# EAGLE design smart hub v2_1 (EAGLE 9.6.2)
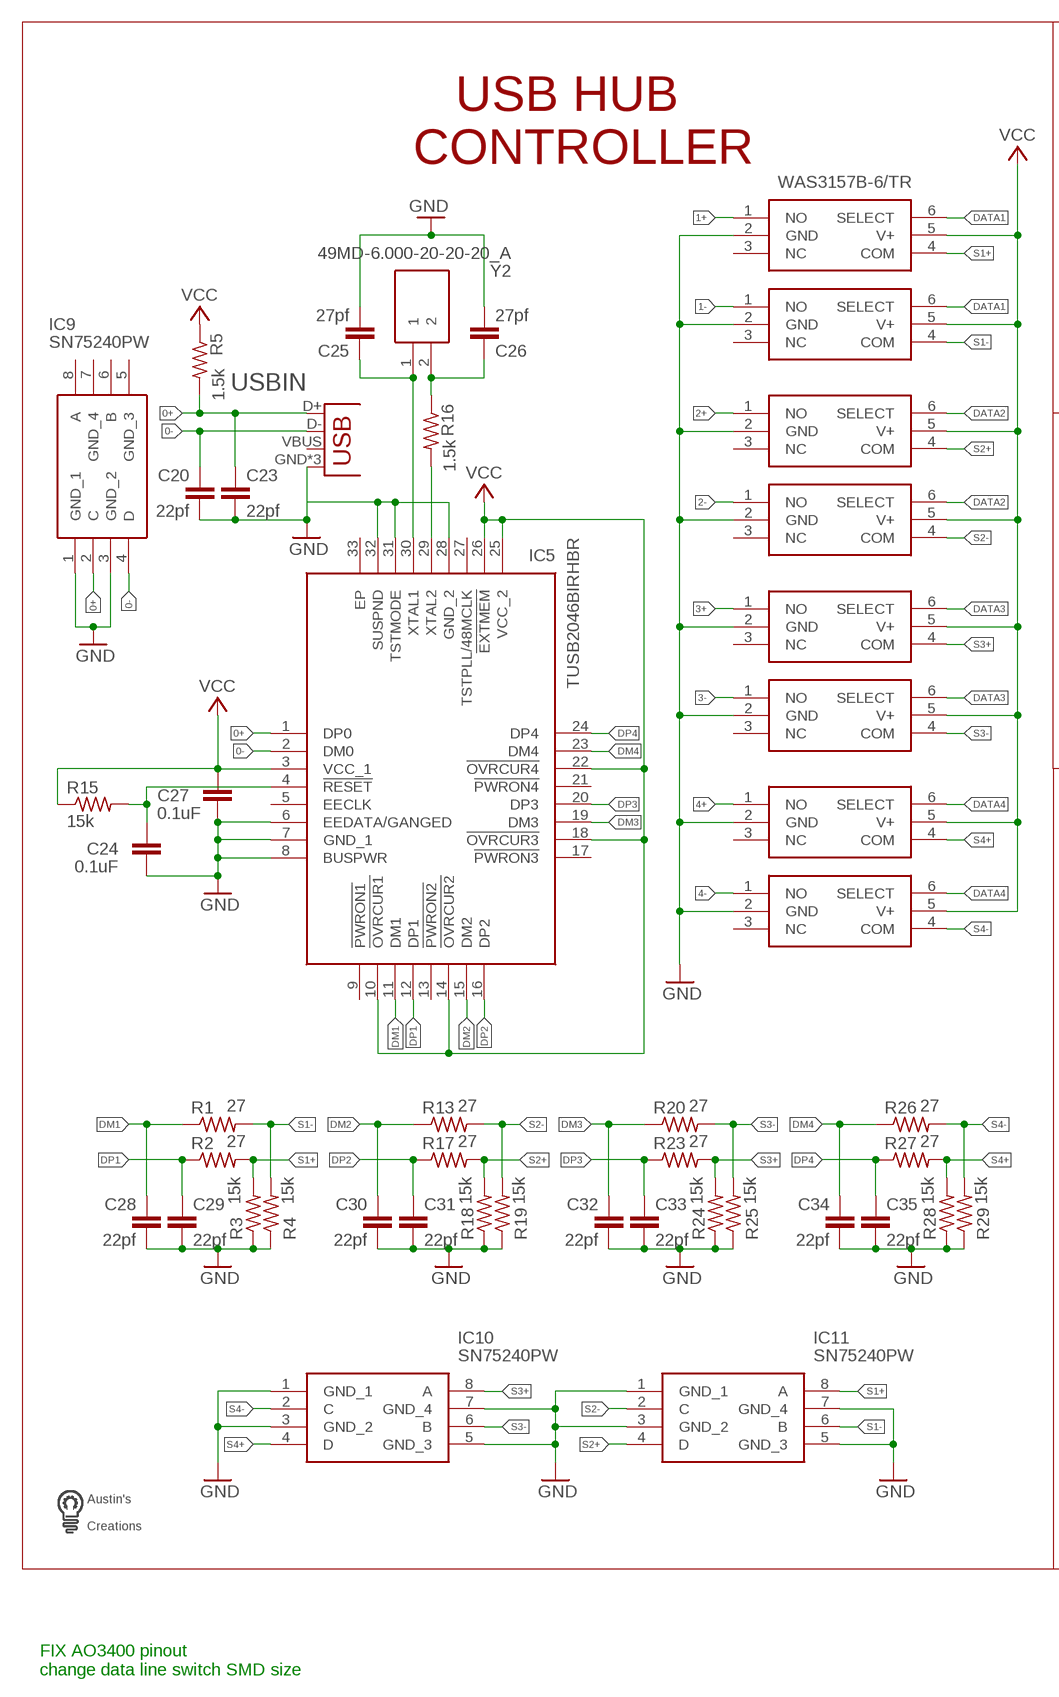
[diagram p0: schematic, sheet 1, part 1 of 2]
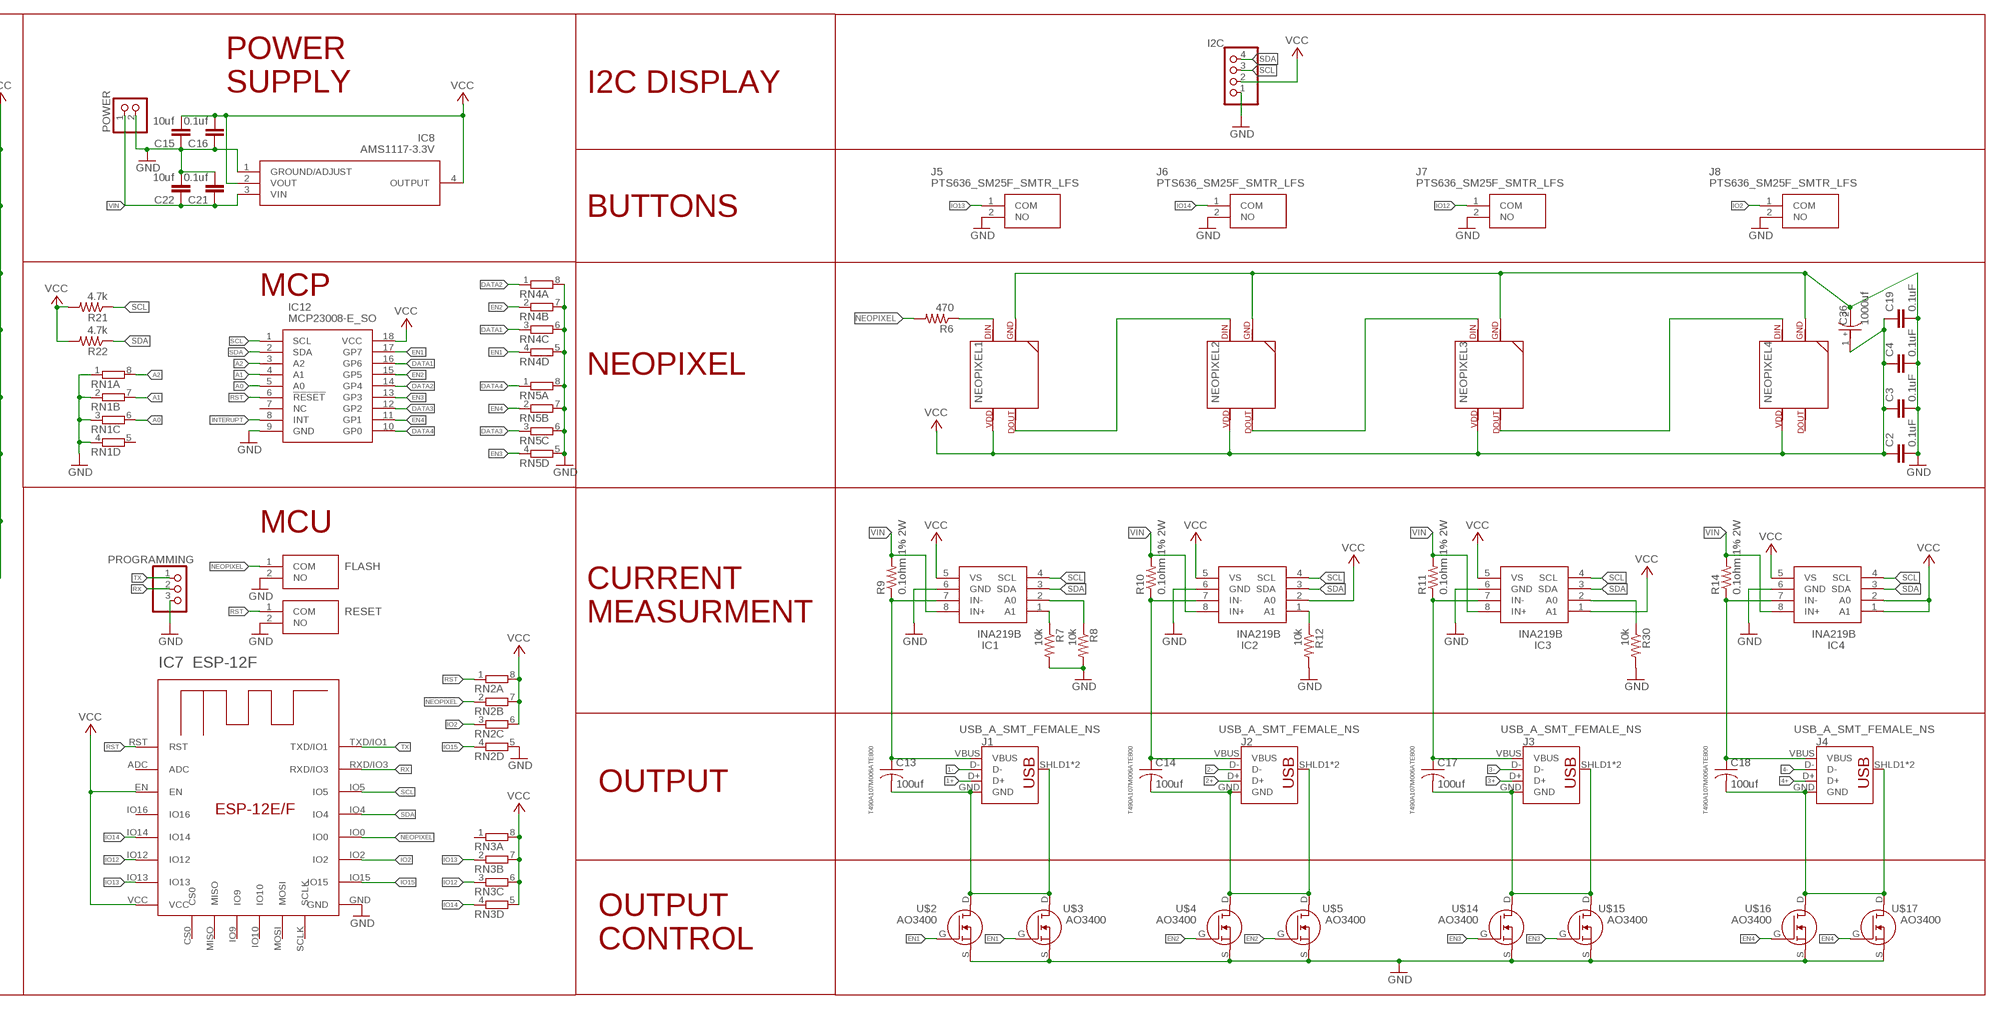
[diagram p1: schematic, sheet 1, part 2 of 2]

## Parts
C2  0.1uF  C-EUC0603  [C0603]
C3  0.1uF  C-EUC0603  [C0603]
C4  0.1uF  C-EUC0603  [C0603]
C13  100uf  C-USC1206  [C1206]
C14  100uf  C-USC1206  [C1206]
C15  10uf  C-EUC0603  [C0603]
C16  0.1uf  C-EUC0603  [C0603]
C17  100uf  C-USC1206  [C1206]
C18  100uf  C-USC1206  [C1206]
C19  0.1uF  C-EUC0603  [C0603]
C20  22pf  C-EUC0603  [C0603]
C21  0.1uf  C-EUC0603  [C0603]
C22  10uf  C-EUC0603  [C0603]
C23  22pf  C-EUC0603  [C0603]
C24  0.1uF  C-EUC0603  [C0603]
C25  27pf  C-EUC0603  [C0603]
C26  27pf  C-EUC0603  [C0603]
C27  0.1uF  C-EUC0603  [C0603]
C28  22pf  C-EUC0603  [C0603]
C29  22pf  C-EUC0603  [C0603]
C30  22pf  C-EUC0603  [C0603]
C31  22pf  C-EUC0603  [C0603]
C32  22pf  C-EUC0603  [C0603]
C33  22pf  C-EUC0603  [C0603]
C34  22pf  C-EUC0603  [C0603]
C35  22pf  C-EUC0603  [C0603]
C36  1000uf  EEE-0JA102P  [CAPAE1030X1050N]
FLASH  PTS636_SM25F_SMTR_LFS  [PTS636SM25FSMTRLFS]
I2C  PINHD-1X4  [1X04]
IC1  INA219B  INA219AIDR  [SOIC127P600X175-8N]
IC2  INA219B  INA219AIDR  [SOIC127P600X175-8N]
IC3  INA219B  INA219AIDR  [SOIC127P600X175-8N]
IC4  INA219B  INA219AIDR  [SOIC127P600X175-8N]
IC5  TUSB2046BIRHBR  [QFN50P500X500X100-33N]
IC7  ESP-12F  ESP-12E/F  [ESP-12E]
IC8  AMS1117-3.3V  [SOT229P700X180-4N]
IC9  SN75240PW  [SOP65P640X120-8N]
IC10  SN75240PW  [SOP65P640X120-8N]
IC11  SN75240PW  [SOP65P640X120-8N]
IC12  MCP23008-E_SO  [SOIC127P1030X265-18N]
J1  USB_A_SMT_FEMALE_NS  [USB-A-S-NOSILK-FEMALE]
J2  USB_A_SMT_FEMALE_NS  [USB-A-S-NOSILK-FEMALE]
J3  USB_A_SMT_FEMALE_NS  [USB-A-S-NOSILK-FEMALE]
J4  USB_A_SMT_FEMALE_NS  [USB-A-S-NOSILK-FEMALE]
J5  PTS636_SM25F_SMTR_LFS  [PTS636SM25FSMTRLFS]
J6  PTS636_SM25F_SMTR_LFS  [PTS636SM25FSMTRLFS]
J7  PTS636_SM25F_SMTR_LFS  [PTS636SM25FSMTRLFS]
J8  PTS636_SM25F_SMTR_LFS  [PTS636SM25FSMTRLFS]
NEOPIXEL1  SK6812NEOPIXEL5050  [SK6812]
NEOPIXEL2  SK6812NEOPIXEL5050  [SK6812]
NEOPIXEL3  SK6812NEOPIXEL5050  [SK6812]
NEOPIXEL4  SK6812NEOPIXEL5050  [SK6812]
POWER  PINHD-1X2  [1X02]
PROGRAMMING  PINHD-1X3  [1X03]
R1  27  R-US_R0603  [R0603]
R2  27  R-US_R0603  [R0603]
R3  15k  R-US_R0603  [R0603]
R4  15k  R-US_R0603  [R0603]
R5  1.5k  R-US_R0603  [R0603]
R6  470  R-US_R0603  [R0603]
R7  10k  R-US_R0603  [R0603]
R8  10k  R-US_R0603  [R0603]
R9  0.1ohm 1% 2W  R-US_R2512W  [R2512W]
R10  0.1ohm 1% 2W  R-US_R2512W  [R2512W]
R11  0.1ohm 1% 2W  R-US_R2512W  [R2512W]
R12  10k  R-US_R0603  [R0603]
R13  27  R-US_R0603  [R0603]
R14  0.1ohm 1% 2W  R-US_R2512W  [R2512W]
R15  15k  R-US_R0603  [R0603]
R16  1.5k  R-US_R0603  [R0603]
R17  27  R-US_R0603  [R0603]
R18  15k  R-US_R0603  [R0603]
R19  15k  R-US_R0603  [R0603]
R20  27  R-US_R0603  [R0603]
R21  4.7k  R-US_R0603  [R0603]
R22  4.7k  R-US_R0603  [R0603]
R23  27  R-US_R0603  [R0603]
R24  15k  R-US_R0603  [R0603]
R25  15k  R-US_R0603  [R0603]
R26  27  R-US_R0603  [R0603]
R27  27  R-US_R0603  [R0603]
R28  15k  R-US_R0603  [R0603]
R29  15k  R-US_R0603  [R0603]
R30  10k  R-US_R0603  [R0603]
RESET  PTS636_SM25F_SMTR_LFS  [PTS636SM25FSMTRLFS]
RN1  4R-N0603-ARC  [0603-ARC]
RN2  4R-N0603-ARC  [0603-ARC]
RN3  4R-N0603-ARC  [0603-ARC]
RN4  4R-N0603-ARC  [0603-ARC]
RN5  4R-N0603-ARC  [0603-ARC]
U$1  LOGOMASSIVE  [LOGOMASSIVE]
U$2  AO3400  [AO3400]
U$3  AO3400  [AO3400]
U$4  AO3400  [AO3400]
U$5  AO3400  [AO3400]
U$6  WAS3157B-6/TR  [WAS3157B-6/TR]
U$7  WAS3157B-6/TR  [WAS3157B-6/TR]
U$8  WAS3157B-6/TR  [WAS3157B-6/TR]
U$9  WAS3157B-6/TR  [WAS3157B-6/TR]
U$10  WAS3157B-6/TR  [WAS3157B-6/TR]
U$11  WAS3157B-6/TR  [WAS3157B-6/TR]
U$12  WAS3157B-6/TR  [WAS3157B-6/TR]
U$13  WAS3157B-6/TR  [WAS3157B-6/TR]
U$14  AO3400  [AO3400]
U$15  AO3400  [AO3400]
U$16  AO3400  [AO3400]
U$17  AO3400  [AO3400]
USBIN  USB-MICROB  [USB-MICROB]
Y2  49MD-6.000-20-20-20_A  [49MD6000202020A]

## Nets
0+: C23.1 IC5.1(DP0) IC9.2(C) R5.2 USBIN.D+
0-: C20.1 IC5.2(DM0) IC9.4(D) USBIN.D-
1+: J1.D+ U$6.1(NO)
1-: J1.D- U$7.1(NO)
2+: J2.D+ U$8.1(NO)
2-: J2.D- U$9.1(NO)
3+: J3.D+ U$10.1(NO)
3-: J3.D- U$11.1(NO)
4+: J4.D+ U$12.1(NO)
4-: J4.D- U$13.1(NO)
A0: IC12.5(A0) RN1.6
A1: IC12.4(A1) RN1.7
A2: IC12.3(A2) RN1.8
DATA1: IC12.16(GP6) RN4.3 U$6.6(SELECT) U$7.6(SELECT)
DATA2: IC12.14(GP4) RN4.1 U$8.6(SELECT) U$9.6(SELECT)
DATA3: IC12.12(GP2) RN5.3 U$10.6(SELECT) U$11.6(SELECT)
DATA4: IC12.10(GP0) RN5.1 U$12.6(SELECT) U$13.6(SELECT)
DM1: C28.1 IC5.11(DM1) R1.1
DM2: C30.1 IC5.15(DM2) R13.1
DM3: C32.1 IC5.19(DM3) R20.1
DM4: C34.1 IC5.23(DM4) R26.1
DP1: C29.1 IC5.12(DP1) R2.1
DP2: C31.1 IC5.16(DP2) R17.1
DP3: C33.1 IC5.20(DP3) R23.1
DP4: C35.1 IC5.24(DP4) R27.1
EN1: IC12.17(GP7) RN4.4 U$2.G U$3.G
EN2: IC12.15(GP5) RN4.2 U$4.G U$5.G
EN3: IC12.13(GP3) RN5.4 U$14.G U$15.G
EN4: IC12.11(GP1) RN5.2 U$16.G U$17.G
GND: C2.2 C3.2 C4.2 C15.1 C16.1 C19.2 C20.2 C21.2 C22.2 C23.2 C24.2 C25.2 C26.2 C27.2 C28.2 C29.2 C30.2 C31.2 C32.2 C33.2 C34.2 C35.2 C36.2(-) FLASH.2(NO) I2C.1 IC1.6(GND) IC2.6(GND) IC3.6(GND) IC4.6(GND) IC5.6(EEDATA/GANGED) IC5.7(GND_1) IC5.8(BUSPWR) IC5.28(GND_2) IC5.31(TSTMODE) IC5.32(SUSPND) IC7.GND IC8.1(GROUND/ADJUST) IC9.1(GND_1) IC9.3(GND_2) IC10.1(GND_1) IC10.3(GND_2) IC10.5(GND_3) IC10.7(GND_4) IC11.1(GND_1) IC11.3(GND_2) IC11.5(GND_3) IC11.7(GND_4) IC12.9(GND) J5.2(NO) J6.2(NO) J7.2(NO) J8.2(NO) NEOPIXEL1.3(GND) NEOPIXEL2.3(GND) NEOPIXEL3.3(GND) NEOPIXEL4.3(GND) POWER.2 PROGRAMMING.3 R3.1 R4.1 R7.2 R8.2 R12.2 R18.1 R19.1 R24.1 R25.1 R28.1 R29.1 R30.2 RESET.2(NO) RN1.1 RN1.2 RN1.3 RN1.4 RN2.5 RN4.5 RN4.6 RN4.7 RN4.8 RN5.5 RN5.6 RN5.7 RN5.8 U$2.S U$3.S U$4.S U$5.S U$6.2(GND) U$7.2(GND) U$8.2(GND) U$9.2(GND) U$10.2(GND) U$11.2(GND) U$12.2(GND) U$13.2(GND) U$14.S U$15.S U$16.S U$17.S USBIN.GND USBIN.MT1(GND) USBIN.MT2(GND)
INTERUPT: IC12.8(INT)
IO2: IC7.IO2 J8.1(COM) RN2.3
IO12: IC7.IO12 J7.1(COM) RN3.3
IO13: IC7.IO13 J5.1(COM) RN3.2
IO14: IC7.IO14 J6.1(COM) RN3.4
IO15: IC7.IO15 RN2.4
N$1: C13.2 J1.GND J1.SHLD1(SHIELD) J1.SHLD2(SHIELD) U$2.D U$3.D
N$2: C14.2 J2.GND J2.SHLD1(SHIELD) J2.SHLD2(SHIELD) U$4.D U$5.D
N$3: C25.1 IC5.30(XTAL1) Y2.1
N$4: C24.1 IC5.4(!RESET) R15.2
N$5: C26.1 R16.1 Y2.2
N$6: C17.2 J3.GND J3.SHLD1(SHIELD) J3.SHLD2(SHIELD) U$14.D U$15.D
N$7: IC5.29(XTAL2) R16.2
N$9: NEOPIXEL1.2(DOUT) NEOPIXEL2.4(DIN)
N$10: NEOPIXEL2.2(DOUT) NEOPIXEL3.4(DIN)
N$12: C18.2 J4.GND J4.SHLD1(SHIELD) J4.SHLD2(SHIELD) U$16.D U$17.D
N$13: IC3.2(A0) R30.1
N$14: IC2.1(A1) R12.1
N$15: IC1.1(A1) R7.1
N$16: IC1.2(A0) R8.1
N$17: NEOPIXEL1.4(DIN) R6.1
N$19: C13.1 IC1.7(IN-) J1.VBUS R9.1
N$20: NEOPIXEL3.2(DOUT) NEOPIXEL4.4(DIN)
N$21: C14.1 IC2.7(IN-) J2.VBUS R10.1
N$22: C17.1 IC3.7(IN-) J3.VBUS R11.1
N$24: C18.1 IC4.7(IN-) J4.VBUS R14.1
NEOPIXEL: FLASH.1(COM) IC7.IO0 R6.2 RN2.2
RST: IC7.RST IC12.6(!RESET) RESET.1(COM) RN2.1
RX: IC7.RXD/IO3 PROGRAMMING.2
S1+: IC11.8(A) R2.2 R3.2 U$6.4(COM)
S1-: IC11.6(B) R1.2 R4.2 U$7.4(COM)
S2+: IC11.4(D) R17.2 R18.2 U$8.4(COM)
S2-: IC11.2(C) R13.2 R19.2 U$9.4(COM)
S3+: IC10.8(A) R23.2 R24.2 U$10.4(COM)
S3-: IC10.6(B) R20.2 R25.2 U$11.4(COM)
S4+: IC10.4(D) R27.2 R28.2 U$12.4(COM)
S4-: IC10.2(C) R26.2 R29.2 U$13.4(COM)
SCL: I2C.3 IC1.4(SCL) IC2.4(SCL) IC3.4(SCL) IC4.4(SCL) IC7.IO5 IC12.1(SCL) R21.1
SDA: I2C.4 IC1.3(SDA) IC2.3(SDA) IC3.3(SDA) IC4.3(SDA) IC7.IO4 IC12.2(SDA) R22.1
TX: IC7.TXD/IO1 PROGRAMMING.1
VCC: C2.1 C3.1 C4.1 C15.2 C16.2 C19.1 C27.1 C36.1(+) I2C.2 IC1.5(VS) IC2.2(A0) IC2.5(VS) IC3.1(A1) IC3.5(VS) IC4.1(A1) IC4.2(A0) IC4.5(VS) IC5.3(VCC_1) IC5.10(!OVRCUR1) IC5.14(!OVRCUR2) IC5.18(!OVRCUR3) IC5.22(!OVRCUR4) IC5.25(VCC_2) IC5.26(!EXTMEM) IC7.EN IC7.VCC IC8.2(VOUT) IC8.4(OUTPUT) IC12.18(VCC) NEOPIXEL1.1(VDD) NEOPIXEL2.1(VDD) NEOPIXEL3.1(VDD) NEOPIXEL4.1(VDD) R5.1 R15.1 R21.2 R22.2 RN2.6 RN2.7 RN2.8 RN3.5 RN3.6 RN3.7 RN3.8 U$6.5(V+) U$7.5(V+) U$8.5(V+) U$9.5(V+) U$10.5(V+) U$11.5(V+) U$12.5(V+) U$13.5(V+)
VIN: C21.1 C22.1 IC1.8(IN+) IC2.8(IN+) IC3.8(IN+) IC4.8(IN+) IC8.3(VIN) POWER.1 R9.2 R10.2 R11.2 R14.2
Unconnected: IC5.5(EECLK) IC5.9(!PWRON1) IC5.13(!PWRON2) IC5.17(!PWRON3) IC5.21(!PWRON4) IC5.27(TSTPLL/48MCLK) IC5.33(EP) IC7.ADC IC7.CS0 IC7.IO9 IC7.IO10 IC7.IO16 IC7.MISO IC7.MOSI IC7.SCLK IC9.5(GND_3) IC9.6(B) IC9.7(GND_4) IC9.8(A) IC12.7(NC) NEOPIXEL4.2(DOUT) RN1.5 RN3.1 U$6.3(NC) U$7.3(NC) U$8.3(NC) U$9.3(NC) U$10.3(NC) U$11.3(NC) U$12.3(NC) U$13.3(NC) USBIN.VBUS

## Notes on the sheet
- POWER
  SUPPLY
- I2C DISPLAY
- USB HUB
  CONTROLLER
- BUTTONS
- MCP
- NEOPIXEL
- MCU
- CURRENT
  MEASURMENT
- OUTPUT
- T490A107M006ATE800 | T490A107M006ATE800 | T490A107M006ATE800 | T490A107M006ATE800
- OUTPUT
  CONTROL
- FIX AO3400 pinout
  change data line switch SMD size

## Library data of the parts
C2-C4 C15 C16 C19-C35 = rcl:C-EU: CAPACITOR, European symbol; SPICEPREFIX: C
C13 C14 C17 C18 = custom parts:C-US: CAPACITOR, American symbol; SPICEPREFIX: C
C36 = SamacSys_Parts:EEE-0JA102P: Panasonic 1000uF 6.3 V Aluminium Electrolytic Capacitor G, S(V) Series 2000h 10 x 10.2mm Source: Datasheet <https://componentsearchengine.com/Datasheets/1/EEE-0JA102P.pdf>; DESCRIPTION: Panasonic 1000uF 6.3 V Aluminium Electrolytic Capacitor G, S(V) Series 2000h 10 x 10.2mm; HEIGHT: 10.5mm; MANUFACTURER_NAME: Panasonic; MANUFACTURER_PART_NUMBER: EEE-0JA102P; MOUSER_PART_NUMBER: 667-EEE-0JA102P; MOUSER_PRICE-STOCK: https://www.mouser.com/Search/Refine.aspx?Keyword=667-EEE-0JA102P
FLASH J5-J8 RESET = SamacSys_Parts:PTS636_SM25F_SMTR_LFS: Tactile Switches Tact 50mA 12VDC, 6.0x3.5, 2.5mm H, 180gf, F leads, No ground pin, White Actuator Source: Datasheet <https://ms.componentsearchengine.com/Datasheets/1/PTS636 SM25F SMTR LFS.pdf>; ARROW_PART_NUMBER: PTS636 SM25F SMTR LFS; ARROW_PRICE-STOCK: https://www.arrow.com/en/products/pts636-sm25f-smtr-lfs/ck; DESCRIPTION: Tactile Switches Tact 50mA 12VDC, 6.0x3.5, 2.5mm H, 180gf, F leads, No ground pin, White Actuator; HEIGHT: 2.7mm; MANUFACTURER_NAME: C & K COMPONENTS; MANUFACTURER_PART_NUMBER: PTS636 SM25F SMTR LFS; MOUSER_PART_NUMBER: 611-PTS636SM25FSMTRL; MOUSER_PRICE-STOCK: https://www.mouser.co.uk/ProductDetail/CK/PTS636-SM25F-SMTR-LFS?qs=vLWxofP3U2wcBTQSwfMFOw%3D%3D
I2C = custom parts:PINHD-1X4: PIN HEADER
IC1-IC4 = SamacSys_Parts:INA219AIDR: 26-V, Bidirectional, Zero-Drift, High-Side, I2C Out Current/Power Monitor Source: Datasheet <http://www.ti.com/lit/gpn/ina219>; ARROW_PART_NUMBER: INA219AIDR; ARROW_PRICE-STOCK: https://www.arrow.com/en/products/ina219aidr/texas-instruments; DESCRIPTION: 26-V, Bidirectional, Zero-Drift, High-Side, I2C Out Current/Power Monitor; HEIGHT: 1.75mm; MANUFACTURER_NAME: Texas Instruments; MANUFACTURER_PART_NUMBER: INA219AIDR; MOUSER_PART_NUMBER: 595-INA219AIDR; MOUSER_PRICE-STOCK: https://www.mouser.co.uk/ProductDetail/Texas-Instruments/INA219AIDR?qs=XGzIaZb%2FFYIE5YcOHTnKDA%3D%3D
IC5 = SamacSys_Parts:TUSB2046BIRHBR: 4-Port USB 2.0 12 Mbps USB Full-Speed Hub Source: Datasheet <http://www.ti.com/lit/gpn/tusb2046b>; DESCRIPTION: 4-Port USB 2.0 12 Mbps USB Full-Speed Hub; HEIGHT: 1mm; MANUFACTURER_NAME: Texas Instruments; MANUFACTURER_PART_NUMBER: TUSB2046BIRHBR; MOUSER_PART_NUMBER: 595-TUSB2046BIRHBR; MOUSER_PRICE-STOCK: https://www.mouser.co.uk/ProductDetail/Texas-Instruments/TUSB2046BIRHBR?qs=0OHPnBYoB%2Fm43hGx4HiInw%3D%3D
IC7 = custom parts:ESP-12E/F
IC8 = SamacSys_Parts:AMS1117-3.3V: 1A LOW DROPOUT VOLTAGE REGULATOR, SOT-223 Source: Datasheet <http://www.advanced-monolithic.com/pdf/ds1117.pdf>; DESCRIPTION: 1A LOW DROPOUT VOLTAGE REGULATOR, SOT-223; HEIGHT: 1.8mm; MANUFACTURER_NAME: Advanced Monolithic Systems; MANUFACTURER_PART_NUMBER: ams1117-3.3v
IC9-IC11 = SamacSys_Parts:SN75240PW: Dual USB Port Transient Suppressor Source: Datasheet; DESCRIPTION: Dual USB Port Transient Suppressor; HEIGHT: 1.2mm; MANUFACTURER_NAME: Texas Instruments; MANUFACTURER_PART_NUMBER: SN75240PW; MOUSER_PART_NUMBER: 595-SN75240PW; MOUSER_PRICE-STOCK: https://www.mouser.co.uk/ProductDetail/Texas-Instruments/SN75240PW?qs=q2XTDbzbm6CHHo1l5fz%2Fyw%3D%3D
IC12 = SamacSys_Parts:MCP23008-E_SO: 8-bit I/O Expander,I2C,MCP23008-E/SO Source: Datasheet <http://docs-emea.rs-online.com/webdocs/0a78/0900766b80a784b7.pdf>; ARROW_PART_NUMBER: MCP23008-E/SO; ARROW_PRICE-STOCK: https://www.arrow.com/en/products/mcp23008-eso/microchip-technology; DESCRIPTION: 8-bit I/O Expander,I2C,MCP23008-E/SO; HEIGHT: 2.65mm; MANUFACTURER_NAME: Microchip; MANUFACTURER_PART_NUMBER: MCP23008-E/SO; MOUSER_PART_NUMBER: 579-MCP23008-E/SO; MOUSER_PRICE-STOCK: https://www.mouser.co.uk/ProductDetail/Microchip-Technology/MCP23008-E-SO?qs=Sez7gRs8XSWum74ZwQXTLw%3D%3D
J1-J4 = custom parts:USB_A: USB-A Connector Male and female variants, as well as PTH and SMT variants SparkFun Products: SparkFun XBee Explorer Dongle <https://www.sparkfun.com/products/11697> PTH Male SparkFun MicroView-USB Programmer <https://www.sparkfun.com/products/12924> SMT Male SparkFun USB Type A Female Breakout <https://www.sparkfun.com/products/12700> SMT Female; PROD_ID: CONN-09520; SF_ID: PRT-09011
NEOPIXEL1-NEOPIXEL4 = custom parts:SK6812: for 5050 sk6812 LED
POWER = pinhead:PINHD-1X2: PIN HEADER
PROGRAMMING = custom parts:PINHD-1X3: PIN HEADER
R1-R30 = rcl:R-US_: RESISTOR, American symbol; SPICEPREFIX: R
RN1-RN5 = custom parts:4R-N: Array Chip Resistor Source: RS Component / Phycomp; OC_FARNELL: unknown; OC_NEWARK: unknown
U$1 = custom parts:LOGOMASSIVE
U$2-U$5 U$14-U$17 = custom parts:AO3400: AO3400 N-channel MOSFET Transistor, 5 A, 30 V, 3-Pin SOT-23; DESCRIPTION: AO3400 N-channel MOSFET Transistor, 5 A, 30 V, 3-Pin SOT-23; HEIGHT: 1.12mm
U$6-U$13 = custom parts:WAS3157B-6/TR: Low Voltage Single Supply SPDT Analog Switch Source: Datasheet <https://componentsearchengine.com/Datasheets/1/NLAST4599DFT2G.pdf>; DESCRIPTION: Low Voltage Single Supply SPDT Analog Switch; HEIGHT: 1.1mm
USBIN = custom parts:USB: USB Connectors USB-B-PTH is fully proven SKU : PRT-00139/CONN-08278 USB-miniB is fully proven SKU : PRT-00587 USB-A-PCB is untested. USB-A-H is throughly reviewed, but untested. Spark Fun Electronics SKU : PRT-00437 USB-B-SMT is throughly reviewed, but untested. Needs silkscreen touching up. USB-A-S has not been used/tested USB-MB-H has not been used/tested USB-MICROB has been used. CONN-09505; PROD_ID: CONN-09505
Y2 = SamacSys_Parts:49MD-6.000-20-20-20_A: 12.5 x 4.5 Crystal Source: Datasheet <https://datasheet.lcsc.com/szlcsc/Suzhou-Liming-Elec-49MD-6-000-20-20-20-A_C240973.pdf>; DESCRIPTION: 12.5 x 4.5 Crystal; HEIGHT: 4.2mm; MANUFACTURER_NAME: LIMING; MANUFACTURER_PART_NUMBER: 49MD-6.000-20-20-20/A

## Board
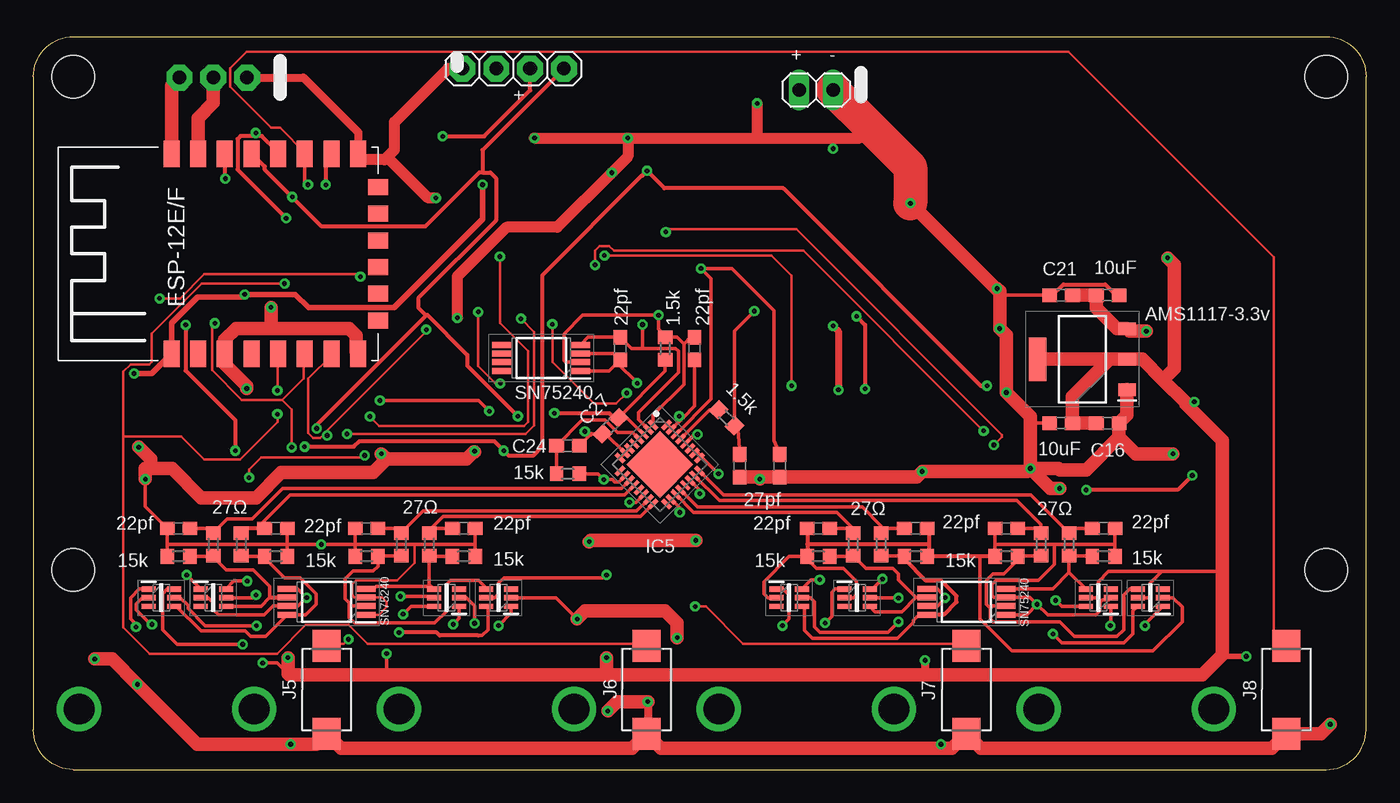
[diagram p2: board, top side]
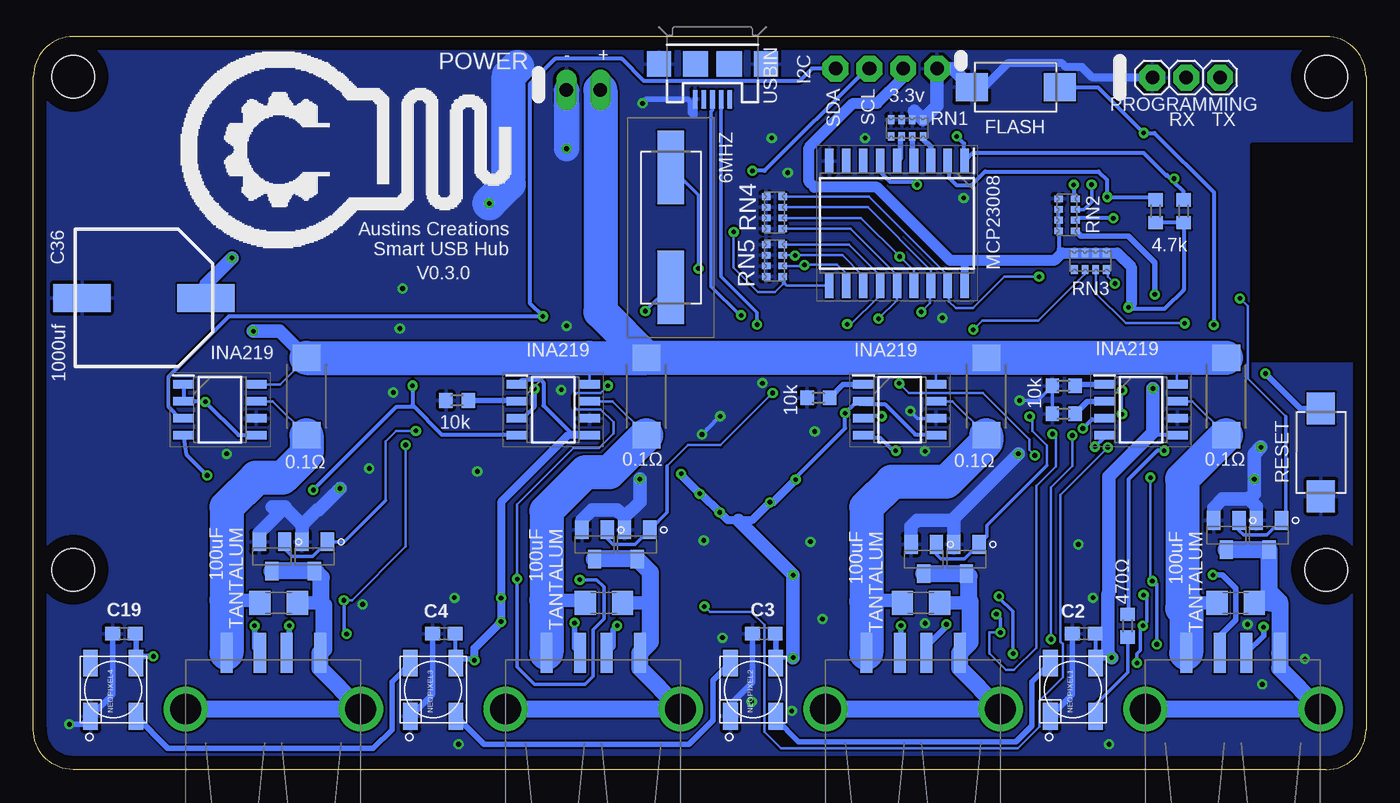
[diagram p3: board, bottom side, seen from below]

Size 100 x 55 mm. Coordinates in mm from the lower left corner, seen from the top.
Outline: 3,0 97,0 arc90 100,3 100,52 arc90 97,55 3,55 arc90 0,52 0,3 arc90 3,0
Copper layers (1*16): Top 0.035mm / dielectric 1.5mm / Bottom 0.035mm
Design rules "default *": minimum track width 8mil, minimum drill 0.35mm, track to track 6mil, track to pad 6mil, pad to pad 6mil, via to via 6mil, smd to smd 6mil, copper to edge 40mil, drill to drill 6mil, minimum pad ring 10mil, minimum via ring 8mil, stop-mask expansion 4mil, vias tented up to drill 0mil, thermal gap 10mil
Holes 3.2 mm at 3,15 97,15 3,52 97,52
tRestrict: area 0.3,30.8 to 8.5,46.9
bRestrict: area 0.3,30.8 to 8.5,46.9

### Footprints (pad centres in the part's own frame; a part is rotated, then mirrored left to right if it is on the bottom)
C0603 = smd 1.1 x 1: 1 -0.85,0; 2 0.85,0
C1206 = smd 1.6 x 1.8: 1 -1.4,0; 2 1.4,0
CAPAE1030X1050N = smd 4.3 x 2.1: 1 -4.65,0; 2 4.65,0
PTS636SM25FSMTRLFS = smd 2.4 x 2.1: 1 -3.3,0; 2 3.3,0
1X04 = drill 1.016 pad 1.93 octagon: 1 -3.81,0; 2 -1.27,0; 3 1.27,0; 4 3.81,0
SOIC127P600X175-8N = smd 1.55 x 0.65: 1 -2.725,1.905; 2 -2.725,0.635; 3 -2.725,-0.635; 4 -2.725,-1.905; 5 2.725,-1.905; 6 2.725,-0.635; 7 2.725,0.635; 8 2.725,1.905
QFN50P500X500X100-33N = smd 0.85 x 0.3: 1 -2.45,1.75; 2 -2.45,1.25; 3 -2.45,0.75; 4 -2.45,0.25; 5 -2.45,-0.25; 6 -2.45,-0.75; 7 -2.45,-1.25; 8 -2.45,-1.75; 17 2.45,-1.75; 18 2.45,-1.25; 19 2.45,-0.75; 20 2.45,-0.25; 21 2.45,0.25; 22 2.45,0.75; 23 2.45,1.25; 24 2.45,1.75 | smd 0.3 x 0.85: 9 -1.75,-2.45; 10 -1.25,-2.45; 11 -0.75,-2.45; 12 -0.25,-2.45; 13 0.25,-2.45; 14 0.75,-2.45; 15 1.25,-2.45; 16 1.75,-2.45; 25 1.75,2.45; 26 1.25,2.45; 27 0.75,2.45; 28 0.25,2.45; 29 -0.25,2.45; 30 -0.75,2.45; 31 -1.25,2.45; 32 -1.75,2.45 | smd 3.55 x 3.55: 33 0,0
ESP-12E = smd 2 x 1.2: ADC -7.46,5.53; EN -7.46,3.53; GND 7.54,-6.47; IO0 7.54,-0.47; IO2 7.54,-2.47; IO4 7.54,1.53; IO5 7.54,3.53; IO12 -7.46,-2.47; IO13 -7.46,-4.47; IO14 -7.46,-0.47; IO15 7.54,-4.47; IO16 -7.46,1.53; RST -7.46,7.53; RXD/IO3 7.54,5.53; TXD/IO1 7.54,7.53; VCC -7.46,-6.47 | smd 1.2 x 1.5: CS0 -4.96,-7.97; IO9 -0.96,-7.97; IO10 1.04,-7.97; MISO -2.96,-7.97; MOSI 3.04,-7.97; SCLK 5.04,-7.97
SOT229P700X180-4N = smd 1.3 x 0.95: 1 -3.35,2.29; 2 -3.35,0; 3 -3.35,-2.29 | smd 1.3 x 3.25: 4 3.35,0
SOP65P640X120-8N = smd 1.475 x 0.45: 1 -2.938,0.975; 2 -2.938,0.325; 3 -2.938,-0.325; 4 -2.938,-0.975; 5 2.938,-0.975; 6 2.938,-0.325; 7 2.938,0.325; 8 2.938,0.975
SOIC127P1030X265-18N = smd 1.85 x 0.65: 1 -4.675,5.08; 2 -4.675,3.81; 3 -4.675,2.54; 4 -4.675,1.27; 5 -4.675,0; 6 -4.675,-1.27; 7 -4.675,-2.54; 8 -4.675,-3.81; 9 -4.675,-5.08; 10 4.675,-5.08; 11 4.675,-3.81; 12 4.675,-2.54; 13 4.675,-1.27; 14 4.675,0; 15 4.675,1.27; 16 4.675,2.54; 17 4.675,3.81; 18 4.675,5.08
USB-A-S-NOSILK-FEMALE = smd 3 x 0.9: D+ 6.752,-1; D- 6.752,1; GND 6.752,-3.5; VBUS 6.752,3.5 | drill 2.311: SHLD1 2.54,-6.566; SHLD2 2.54,6.566
SK6812 = smd 2 x 1.1: 1 -2,1.7; 2 -2,-1.7; 3 2,-1.7; 4 2,1.7
1X02 = drill 1.016 long: 1 -1.27,0; 2 1.27,0
1X03 = drill 1.016 pad 1.93 octagon: 1 -2.54,0; 2 0,0; 3 2.54,0
R0603 = smd 1 x 1.1: 1 -0.85,0; 2 0.85,0
R2512W = smd 2 x 2.1: 1 -2.896,0; 2 2.896,0
0603-ARC = smd 0.5 x 0.65: 1 -1.2,-0.625; 2 -0.4,-0.625; 3 0.4,-0.625; 4 1.2,-0.625; 5 1.2,0.625; 6 0.4,0.625; 7 -0.4,0.625; 8 -1.2,0.625
AO3400 = smd 1 x 1.4: D 0,1.1; G -0.95,-1.1; S 0.95,-1.1
WAS3157B-6/TR = smd 1.05 x 0.4: 1 -0.95,0.65; 2 -0.95,0; 3 -0.95,-0.65; 4 0.95,-0.65; 5 0.95,0; 6 0.95,0.65
USB-MICROB = smd 0.35 x 1.4: D+ 0,2.65; D- -0.65,2.65; GND 1.3,2.65; ID 0.65,2.65; VBUS -1.3,2.65 | smd 1.8 x 1.9: MT1 -4,0; MT2 4,0 | smd 1.9 x 1.9: P$1 -1.27,0; P$2 1.27,0
49MD6000202020A = smd 5.5 x 2: 1 -4.5,0; 2 4.5,0

### Placement (x,y rotation side)
C2  21.2,10.2 180 bottom
C3  45.2,10.2 180 bottom
C4  69.2,10.2 180 bottom
C13  9.8,12.5 0 bottom
C14  33.4,12.5 0 bottom
C15  77.1,26 0 top
C16  80.6,26 180 top
C17  57.2,12.5 0 bottom
C18  81.6,12.5 0 bottom
C19  93.2,10.2 180 bottom
C20  44.03,31.6 270 top
C21  77.1,35.6 180 top
C22  80.6,35.6 0 top
C23  49.6,31.6 270 top
C24  40.1,24.3 0 top
C25  56,22.8 270 top
C26  53,22.8 270 top
C27  43.3,25.8 225 top
C28  10.9,18.1 180 top
C29  18.2,18.1 0 top
C30  25,18.1 180 top
C31  32.3,18.1 0 top
C32  58.9,18.1 180 top
C33  66.2,18.1 0 top
C34  73,18.1 180 top
C35  80.3,18.1 0 top
C36  91.7,35.4 180 bottom
FLASH  26.3,51.21 180 bottom
I2C  36,52.6 0 top
IC1  16.9,27 0 bottom
IC2  35,27 0 bottom
IC3  61,27 0 bottom
IC4  86,27 0 bottom
IC5  47,22.9 315 top
IC7  17.9,38.67 90 top
IC8  78.7,30.8 180 top
IC9  38.1,30.9 180 top
IC10  70,12.6 180 top
IC11  22,12.6 180 top
IC12  35.2,41 270 bottom
J1  10,2 90 bottom
J2  34,2 90 bottom
J3  58,2 90 bottom
J4  82,2 90 bottom
J5  22,6 270 top
J6  46,6 270 top
J7  70,6 270 top
J8  94,6 270 top
NEOPIXEL1  22,6 270 bottom
NEOPIXEL2  46,6 270 bottom
NEOPIXEL3  70,6 270 bottom
NEOPIXEL4  94,6 270 bottom
POWER  58.73,51 0 top
PROGRAMMING  13.5,51.93 180 bottom
R1  13.5,16.9 270 top
R2  15.6,16.9 270 top
R3  18.2,16 180 top
R4  10.9,16 0 top
R5  47.4,31.6 90 top
R6  17.9,10.8 90 bottom
R7  22.7,28.8 180 bottom
R8  22.7,26.7 180 bottom
R9  10.5,28 90 bottom
R10  28.5,28 90 bottom
R11  54,28 90 bottom
R12  41.1,27.9 180 bottom
R13  27.6,16.9 270 top
R14  79.5,28 90 bottom
R15  40.1,22.2 180 top
R16  52,26.4 135 top
R17  29.7,16.9 270 top
R18  32.3,16 180 top
R19  25,16 0 top
R20  61.5,16.9 270 top
R21  13.7,41.9 270 bottom
R22  15.8,41.9 270 bottom
R23  63.6,16.9 270 top
R24  66.2,16 180 top
R25  58.9,16 0 top
R26  75.6,16.9 270 top
R27  77.7,16.9 270 top
R28  80.3,16 180 top
R29  73,16 0 top
R30  68.2,27.7 180 bottom
RESET  3.39,23.8 270 bottom
RN1  34.45,48.15 180 bottom
RN2  22.45,41.63 90 bottom
RN3  20.69,38.15 0 bottom
RN4  44.4,41.8 90 bottom
RN5  44.4,38.2 90 bottom
U$1  64.2,39.2 90 bottom
U$2  10.5,17.6 180 bottom
U$3  7.3,17.6 180 bottom
U$4  33.2,15.8 180 bottom
U$5  30,15.8 180 bottom
U$6  9.6,12.9 0 top
U$7  13.5,12.9 0 top
U$8  31,12.9 180 top
U$9  34.9,12.9 180 top
U$10  56.7,12.9 0 top
U$11  61.8,12.9 0 top
U$12  79.9,12.9 180 top
U$13  83.8,12.9 180 top
U$14  57.9,16.9 180 bottom
U$15  54.7,16.9 180 bottom
U$16  82.1,16 180 bottom
U$17  78.9,16 180 bottom
USBIN  49.05,52.95 180 bottom
Y2  52.17,40.68 270 bottom

### Tracks (layer width: path | path; a pad name or v marks a point on that pad's centre or on a via)
0+  (via drill 0.35)
  Top 0.254: IC5.1 46.51,26.61 48.8,28.9 48.8,31.95 | C23.1 49.3,32.45 48.8,31.95 | 48.8,31.95 48.3,32.45 47.5,32.45 | 47.5,32.45 R5.2 | IC9.2 39.92,30.57 39.8,30.7 39.8,32.7 41.2,34.1 v46.9,34.1 46.9,33.05 47.5,32.45
  Bottom 0.254: USBIN.D+ 49.05,49.5 49.15,49.4 49.15,36.25 47,34.1 v46.9,34.1
0-  (via drill 0.35)
  Top 0.254: IC5.2 45.4,26.27 45.4,26.8 48.39,29.79 48.39,31.4 48.19,31.6 45.8,31.6 | 45.8,31.6 44.88,31.6 C20.1 41.61,32.45 IC9.4 | 45.8,31.6 45.7,31.7 v45.7,33.4
  Bottom 0.254: v45.7,33.4 45.7,34.3 48.4,37 USBIN.D-
1+  (via drill 0.35)
  Top 0.254: v7.7,10.7 7.7,10.9 7.3,11.3 7.3,12.9 7.95,13.55 U$6.1
  Bottom 0.406: J1.D+ 7.7,10.05 v7.7,10.7
1-  (via drill 0.35)
  Top 0.254: U$7.1 v11.5,14.6
  Bottom 0.406: v11.5,14.6 10.8,14.6 9.8,13.6 9.8,11.25 11,10.05 J1.D-
2+  (via drill 0.35)
  Top 0.254: U$8.1 31.95,11.35 v31.5,10.9
  Bottom 0.406: v31.5,10.9 31.5,10.75 33,9.25 J2.D+
2-  (via drill 0.35)
  Top 0.254: U$9.1 35.85,11.75 v34.9,10.8
  Bottom 0.406: v34.9,10.8 34.9,8.85 J2.D-
3+  (via drill 0.35)
  Top 0.254: U$10.1 56.25,13.55 56.7,13.1 56.7,11.3 v56.2,10.8
  Bottom 0.406: v56.2,10.8 56.5,10.5 56.5,9.25 J3.D+
3-  (via drill 0.35)
  Top 0.254: U$11.1 60.15,13.55 59.9,13.3 59.9,11.5 v59.4,11
  Bottom 0.406: v59.4,11 59.4,9.15 J3.D-
4+  (via drill 0.35)
  Top 0.254: U$12.1 80.85,10.85 v80.8,10.8
  Bottom 0.406: v80.8,10.8 80.8,8.95 J4.D+
4-  (via drill 0.35)
  Top 0.254: v83.4,10.8 83.4,10.9 U$13.1
  Bottom 0.406: J4.D- 83.4,9.15 v83.4,10.8
A0
  Bottom 0.406: RN1.6 34.95,47.42 34.95,45.92 IC12.5
A1
  Bottom 0.406: RN1.7 34.05,45.8 IC12.4
A2
  Bottom 0.406: RN1.8 33.25,47.33 32.66,46.73 IC12.3
DATA1  (via drill 0.35)
  Top 0.203: v16.18,21.91 16.18,22.51 17.08,23.41 24.86,23.41 v24.86,23.57 | v35.03,28.98 34.67,28.98 33.38,30.27 v33.38,34.35
  Top 0.254: v15.7,9.4 10.8,9.4 9.7,10.5 9.7,13.2 10.05,13.55 U$6.6 | U$7.6 15.04,14.14 v16.04,14.14
  Bottom 0.203: RN4.3 37.4,42.2 32.66,37.46 IC12.16 32.72,36.27 32.72,35.02 v33.38,34.35 | v16.18,21.91 16.18,14.29 v16.04,14.14 | v24.86,23.57 25.26,23.97 25.26,24.77 28.76,28.27 34.31,28.27 v35.03,28.98
  Bottom 0.254: v15.7,9.4 15.7,13.94 15.84,13.94 v16.04,14.14
DATA2  (via drill 0.35)
  Top 0.203: v23.54,25.18 36.93,25.18 37.58,25.84 37.58,32.84 v36.58,33.84
  Top 0.254: 33.38,10.06 33.66,10.06 34.1,10.5 34.1,12.1 U$9.6 | v27.75,11.66 28.34,12.25 U$8.6
  Top 0.305: v27.45,10.29 30.26,10.29 30.49,10.06 33.38,10.06
  Bottom 0.203: RN4.1 38.7,40.6 35.2,37.1 IC12.14 35.2,36.27 35.2,35.22 v36.58,33.84 | v23.54,25.18 23.29,24.94 23.29,22.76 24.76,21.29 24.76,9.12 26.41,7.47 27.03,7.47 28.27,8.71 28.27,10.29 v27.45,10.29
  Bottom 0.254: v27.75,11.66 27.45,11.36 v27.45,10.29
DATA3  (via drill 0.35)
  Top 0.203: v42.85,38.58 55.39,38.58 56.9,37.07 v56.9,28.8
  Top 0.254: U$10.6 58.34,14.24 v59,14.24 | v63.7,14.3 62.95,13.55 U$11.6
  Bottom 0.203: IC12.12 37.74,37.04 39.3,38.6 42.85,38.6 | RN5.3 42.85,38.6 | v56.9,28.8 57.43,28.27 59.21,28.27 59.38,28.09 59.38,27.2 59.21,27.03 57.43,27.03 56.47,26.07 56.47,25.21 57.56,24.12 59.48,24.12 63.7,19.91 63.7,14.66 63.7,14.65 v63.7,14.3 | v42.85,38.58 42.85,38.6
  Bottom 0.254: v59,14.24 57.74,14.24 57.2,13.7 57.2,11.3 58,10.5 58,7 58.6,6.4 62.4,6.4 63.7,7.7 v63.7,14.3
DATA4  (via drill 0.35)
  Top 0.203: v47.45,40.35 47.65,40.55 57.24,40.55 72.67,25.12 72.67,24.96 v72.06,24.36
  Top 0.254: v76.7,12.7 77.15,12.25 U$12.6 | v76.5,10.18 77.17,9.5 81.8,9.5 82.5,10.2 82.5,11.9 U$13.6
  Bottom 0.203: IC12.10 43.48,36.33 43.66,36.5 43.66,36.88 RN5.1 43.77,36.42 44.35,35.85 45.62,35.85 47.45,37.68 v47.45,40.35 | v72.06,24.36 72.06,16.73 76.1,12.7 v76.7,12.7
  Bottom 0.254: v76.7,12.7 76.7,10.38 v76.5,10.18
DM1
  Top 0.254: IC5.11 44.14,21.1 18.7,21.1 16.4,18.8 14.55,18.8 R1.1 13.15,18.1 C28.1
DM2
  Top 0.254: IC5.15 45.27,19.4 29.25,19.4 R13.1 27.25,18.1 C30.1
DM3
  Top 0.254: C32.1 61.15,18.1 R20.1 61.5,18.1 60.31,19.29 49.55,19.29 IC5.19
DM4
  Top 0.254: C34.1 75.25,18.1 R26.1 75.6,18.4 73.81,20.19 51.47,20.19 IC5.23
DP1
  Top 0.254: IC5.12 44.35,20.6 19.25,20.6 16.8,18.15 16,18.15 R2.1 15.95,18.1 C29.1
DP2
  Top 0.254: C31.1 30.05,18.1 R17.1 29.7,17.95 30.74,18.99 45.57,18.99 IC5.16
DP3
  Top 0.254: C33.1 63.95,18.1 R23.1 63.6,18.3 62.2,19.7 49.85,19.7 IC5.20
DP4
  Top 0.254: C35.1 78.05,18.1 R27.1 74.85,20.6 51.77,20.6 IC5.24
EN1  (via drill 0.35)
  Top 0.203: v9.47,35.36 11,35.36 12.82,37.18 24.34,37.18 v24.54,36.98
  Bottom 0.203: RN4.4 37.3,43 31.39,37.09 IC12.17 31.29,36.27 31.29,35.14 30.78,34.63 29.49,34.63 27.14,36.98 v24.54,36.98 | 6.04,26.5 8.89,29.35 8.89,34.78 v9.47,35.36
  Bottom 0.254: U$2.G 9.55,17.95 9.2,17.6 7.45,17.6 U$3.G 6.04,19 6.04,26.5
EN2  (via drill 0.35)
  Top 0.203: v25.25,26.49 25.94,25.8 36.8,25.8 37.1,26.1 37.1,31.4 35,33.5 v35,38.5
  Bottom 0.203: RN4.2 37.9,41.4 v35,38.5 33.93,37.43 IC12.15 | 23.95,22.84 23.95,24.32 25.05,25.43 25.05,26.29 v25.25,26.49
  Bottom 0.254: U$4.G 32.25,16.15 31.9,15.8 30.15,15.8 U$5.G 28.45,17.5 28.45,18.33 23.95,22.84
EN3  (via drill 0.35)
  Top 0.203: v44.53,28.26 43.73,27.46 42.06,27.46 38.94,30.58 v38.94,33.43
  Bottom 0.203: RN5.4 38.8,39.4 36.47,37.07 IC12.13 36.63,36.27 36.63,35.44 38.64,33.43 v38.94,33.43 | 52.45,22.8 50.9,24.36 48.43,24.36 v44.53,28.26
  Bottom 0.254: U$14.G 56.95,17.35 56.5,16.9 54.85,16.9 U$15.G 52.45,19.3 52.45,22.8
EN4  (via drill 0.35)
  Top 0.203: v71.3,25.43 57.78,38.94 43.56,38.94 43.2,39.29 42.49,39.29 42.14,38.94 v42.14,37.87
  Bottom 0.203: IC12.11 39.01,37.21 39.7,37.9 42.11,37.9 v42.14,37.87 42.14,37.8 RN5.2 | 73.58,20.19 73.58,24.61 72.77,25.43 v71.3,25.43
  Bottom 0.254: U$16.G 81.15,16.55 80.6,16 79.05,16 U$17.G 76.67,17.1 73.58,20.19
GND  (via drill 0.35)
  Top 0.203: IC11.1 25.93,11.62 26.5,12.2 26.5,12.6 26.18,12.93 IC11.3 24.07,12.93 23.9,13.1 23.9,13.9 24.2,14.2 27.3,14.2 28.6,15.5 28.6,16.9
  Top 0.254: C29.2 19.05,16.9 | R3.1 19.05,16.9 | 10.05,16.9 C28.2 8.4,19.75 v8.4,21.8 | 10.05,16.9 19.05,16.9 | C30.2 24.15,16.9 | 24.15,16.9 R19.1 | C31.2 33.15,16.9 | 33.15,16.9 R18.1 | 24.15,16.9 28.6,16.9 33.15,16.9 | IC10.7 67.88,12.28 68.4,12.8 v68.4,12.9 68.4,13 67.83,13.57 IC10.5 | IC10.1 74.53,11.62 v75.3,12.4 | v75.3,12.4 74.78,12.93 IC10.3 72.08,12.93 71.91,13.09 71.91,13.9 72.2,14.2 75.4,14.2 76.6,15.4 76.6,16.9 | C34.2 72.15,17 | 72.15,17 R29.1 | 72.15,17 72.25,16.9 76.6,16.9 | C35.2 81.15,16.9 | 81.15,16.9 R28.1 | 76.6,16.9 81.15,16.9 | IC5.7 42.93,25.2 C27.2 41.85,25.2 C24.2 | IC5.6 IC5.7 | IC5.8 | IC5.8 IC5.7 | C23.2 49.6,27.27 48.77,26.44 47.92,25.58 | 47.92,25.58 IC5.31 | IC5.32 47.63,25.87 47.92,25.58 | IC9.3 43.55,31.23 C20.2 43.8,30.52 | IC9.1 43.2,29.93 43.8,30.52 | v45.3,29 45.3,29.03 43.8,30.52 | 19.05,16.9 v21.6,16.9 24.15,16.9 | v26,27.7 33.4,27.7 v34.2,26.9 | C21.2 72.8,35.6 v72.3,36.1 | C15.1 75.3,26 74.8,26.5 | IC11.5 19.82,13.57 v20.5,12.9 19.88,12.28 IC11.7 19.04,12.3 18,12.3 17.3,11.6 13.9,11.6 13.5,12 13.5,12.52 13.12,12.9 U$7.2 | U$6.2 8.18,12.9 7.71,12.43 7.71,12 8.81,10.9 v8.9,10.9 | U$8.2 32.5,12.9 33.1,12.3 v33.1,10.97 | U$9.2 39.2,12.9 v40.8,11.3 | U$11.2 61.52,12.9 61.75,13.13 61.75,14.11 60.77,15.1 58.74,15.1 58.05,15.79 R25.1 56.7,16 54.8,14.1 54.8,13.2 55.1,12.9 U$10.2 | U$12.2 80.68,12.73 80.21,12.73 80,12.52 80,11.9 79.7,11.6 76.1,11.6 v75.3,12.4 | 71,16 71,11.3 73.4,8.9 84,8.9 86.2,11.1 86.2,12.2 85.5,12.9 U$13.2 | 10.05,16.9 R4.1
  Top 0.305: 76,26 C15.1 | C21.2 76.47,35.6 77.28,36.41 80.42,36.41 81.23,35.6 C22.2 | 58.06,16.92 58.06,18.06 C32.2 | 58.06,16.92 58.06,16 R25.1 | 67.21,16.92 67.21,18.06 C33.2 | 67.21,16.92 67.21,16 | v49.84,25.15 49.61,25.15 IC5.28 | 67.21,16 71,16 72.01,16 R29.1 | 67.21,16 R24.1 | v41.38,25.38 41.6,25.15 41.83,25.15 41.85,25.2 | v48.46,26.52 48.69,26.52 48.77,26.44 | 67.21,16.92 58.06,16.92
  Top 0.508: v60,33.3 60.4,32.9 v60.4,28.5
  Top 0.61: v46.1,5.1 46.1,2.8 J6.2 | PROGRAMMING.3 20.27,51.93 24.37,47.83 IC7.GND
  Top 0.813: v37.6,47.4 v44.6,47.4 | v44.6,47.4 44.6,46 v43.4,44.8 39.3,40.7 35.5,40.7 31.8,37 v31.8,33.9 | IC7.GND 24.81,45.77 26.35,45.77 26.55,45.97 | v30.2,42.9 29.62,42.9 26.55,45.97 | 26.55,45.97 27.1,46.52 27.1,48.6 31.1,52.6 I2C.1 | v44.6,47.4 54.3,47.4 | 54.3,47.4 62,47.4 62.8,48.2 | v54.3,50 54.3,47.4
  Top 1.016: IC8.1 82.05,26.6 C16.1 81.45,24.95 | v97.3,3.4 96.6,2.7 J8.2 92.9,1.6 71.1,1.6 J7.2 68.9,1.6 47.1,1.6 J6.2 44.9,1.6 23.1,1.6 J5.2 21.2,1.9 v19.3,1.9 12.3,1.9 v7.8,6.4 5.9,8.3 v4.6,8.3 | v74.8,22.6 76.9,22.6 77,22.5 79,22.5 81.45,24.95 | v77,21.1 76.3,21.1 v74.8,22.6 | v26.1,23.7 26.5,23.3 | v65.8,42.5 72.2,36.1 v72.3,36.1 72.5,35.9 v72.5,33.1 73,32.6 v73,28.3 74.8,26.5 v74.8,22.6 | v7.9,24.2 8.8,23.3 8.8,22.6 | v8.4,21.8 8.4,22.6 8.8,22.6 | 8.8,22.6 10.4,22.6 12.6,20.4 16.7,20.4 18.6,22.3 25.5,22.3 26.5,23.3 | 81.45,24.95 82.7,23.7 v85.5,23.7 | 26.5,23.3 32.5,23.3 33.02,23.82 33.1,23.82 | v41.7,17.1 41.8,17.2 v49.7,17.2 | v40.8,11.3 41.4,11.9 47.4,11.9 48.3,11 v48.3,9.9 | v43.1,4.4 43.8,5.1 v46.1,5.1 | C26.2 54.44,21.95 v54.5,21.8 54.67,21.96 C25.2 66.28,21.96 v66.69,22.37 74.57,22.37 v74.8,22.6
  Top 2.54: POWER.2 62.8,48.2 65.8,45.2 v65.8,42.5
  Bottom 0.203: 44.98,37.87 RN5.7
  Bottom 0.254: RN1.2 33.89,48.94 33.89,49.41 | R8.2 R7.2 24.65,27.7 v26,27.7 | v34.2,26.9 33.66,26.36 IC2.6
  Bottom 0.305: 49.44,25.55 v49.84,25.15 | 49.46,25.55 49.44,25.55 | 49.44,25.55 v48.46,26.52
  Bottom 0.406: C3.2 46.05,6.55 47.7,4.9 NEOPIXEL2.3 | C4.2 70.05,5.65 NEOPIXEL3.3 | C19.2 94.05,5.65 NEOPIXEL4.3 96.3,3.4 v97.3,3.4 | C2.2 22.05,5.65 NEOPIXEL1.3 | USBIN.GND 50.35,49.15 50.4,49.1 50.5,49.1 50.7,49.3 50.7,50.1 50.9,50.3 54,50.3 v54.3,50
  Bottom 0.61: PROGRAMMING.3 20.54,51.93 21.33,52.72 22.52,52.72 22.8,53 26.9,53 28.69,51.21 FLASH.2
  Bottom 1.016: FLASH.2 30.99,52.6 I2C.1 32.19,49.84 RN1.1 33.89,49.41 | U$3.S 8.25,19.75 8.8,20.3 | U$2.S 11.45,19.65 10.8,20.3 8.8,20.3 | 8.8,20.3 8.4,20.7 v8.4,21.8 8.4,23.7 v7.9,24.2 | U$4.S 34.15,18.25 33.7,18.7 31,18.7 | U$5.S 30.95,18.65 31,18.7 | 31,18.7 31.05,18.75 v26.1,23.7 | U$14.S 58.85,18.75 58.1,19.5 56.2,19.5 55.65,18.95 | 55.65,18.95 U$15.S | v54.5,21.8 54.5,20.1 55.65,18.95 | U$17.S 79.85,18.35 | 79.85,18.35 81.2,19.7 82.1,19.7 | 81.1,19.7 83.05,17.75 U$16.S | 79.85,18.35 78.7,19.5 78.6,19.5 v77,21.1
  Bottom 1.905: POWER.2 v60,46.6
  Bottom 2.54: v65.8,42.5 64.34,43.96 64.34,52.07 63.7,52.71
  other vias: 68.1,1.9 33.1,23.9
  pour Bottom: 0,3 0,52 arc-90 3,55 4,55 97,55 arc-90 100,52 100,3 arc-90 97,0 96,0 3,0 arc-90
IO2  (via drill 0.35)
  Top 0.203: J8.1 93.08,10.23 93.08,38.47 77.67,53.87 16,53.87 14.76,52.63 14.76,51.26 17.85,48.17 18.5,48.17 20.45,46.23 IC7.IO2
  Top 0.254: IC7.IO2 20.37,44.13 v20.6,43.9
  Bottom 0.254: RN2.3 21.17,42.03 20.6,42.6 v20.6,43.9
IO12  (via drill 0.35)
  Top 0.203: v13.61,33.49 13.41,33.29 13.41,29.97 15.65,27.74 18.67,27.74 | 18.67,27.74 20.27,29.34 20.27,31.11 IC7.IO12 | v49.65,12.23 50.45,12.23 53.26,9.42 69.88,9.42 J7.1 | v19.38,24.18 19.38,27.03 18.67,27.74
  Bottom 0.203: v13.61,33.49 18.02,33.49 20.27,35.74 20.27,37.52 RN3.3 | v49.65,12.23 49.24,11.82 46.14,11.82 45.16,10.85 45.16,2.85 43.92,1.6 26.14,1.6 24.54,3.2 24.54,5.16 22.76,6.93 22.76,9.42 22.94,9.6 22.94,20.62 v19.38,24.18
IO13  (via drill 0.35)
  Top 0.203: v29.48,33.02 29.48,32.86 21.87,25.25 | 21.87,25.25 21.51,24.89 20.98,24.89 20.62,25.25 20.62,29.34 22.4,31.11 IC7.IO13 | v23.65,9.78 23.29,9.42 22.05,9.42 J5.1 | 21.87,25.25 v22.05,25.07
  Bottom 0.203: v29.48,33.02 28.78,33.72 24.6,33.72 21.16,37.16 21.16,37.52 RN3.2 | v23.65,9.78 23.65,21.17 22.05,22.77 v22.05,25.07
IO14  (via drill 0.35)
  Top 0.203: v18.85,36.47 12.65,36.47 8.89,32.72 8.89,30.58 8.71,30.4 7.29,30.4 6.76,29.87 6.76,25 | 6.76,25 6.76,10.67 8.73,8.69 18.29,8.69 20.45,10.85 23.65,10.85 25.07,9.42 45.87,9.42 J6.1 | v18.31,28.45 18.31,31.11 IC7.IO14 | v18.31,26.67 18.31,26.07 15.51,23.27 12.83,23.27 11.1,25 6.76,25
  Bottom 0.203: v18.85,36.47 19.38,37.01 19.38,37.52 RN3.4 | v18.31,26.67 v18.31,28.45
IO15  (via drill 0.35)
  Top 0.305: v21.95,43.89 21.95,45.95 22.17,46.18 IC7.IO15
  Bottom 0.305: v21.95,43.89 21.95,42.98 RN2.4
N$1
  Bottom 1.27: J1.SHLD2 J1.SHLD1 6.5,7.61 J1.GND 6.5,12.6 6.8,12.9 | 6.8,12.9 7.2,12.5 C13.2 | 6.8,12.9 7.3,13.4 U$3.D U$2.D
N$2
  Bottom 1.016: C14.2 29.8,12.5 29.7,12.6
  Bottom 1.27: J2.SHLD2 J2.SHLD1 30.5,7.61 J2.GND 29.7,9.55 29.7,12.6 | 29.8,12.5 29.8,14.5 U$5.D U$4.D
N$3  (via drill 0.35)
  Top 0.254: IC5.30 50.86,27.82 50.86,36.84 v50.09,37.61 52.43,37.61 55.58,34.46 55.58,24.69 C25.1
  Bottom 0.254: v50.09,37.61 50.09,43.1 Y2.1
N$4
  Top 0.254: R15.2 C24.1 41.17,26.22 42.91,26.22 43.83,25.3 44.95,25.3 IC5.4
N$5  (via drill 0.35)
  Top 0.254: v54.09,34.41 52.6,32.92 R16.1 52.88,25.52 C26.1
  Bottom 0.254: v54.09,34.41 52.32,36.18 Y2.2
N$6
  Bottom 1.016: C17.2 53.8,12.5 53.7,12.6
  Bottom 1.27: J3.SHLD2 J3.SHLD1 54.5,7.61 J3.GND 53.7,9.55 53.7,12.6 53.7,14.8 U$15.D U$14.D
N$7
  Top 0.254: IC5.29 50.75,27 R16.2
N$9
  Bottom 0.406: NEOPIXEL1.2 25.1,6.6 25.1,3.3 26.3,2.1 42.6,2.1 44.3,3.8 NEOPIXEL2.4
N$10
  Bottom 0.406: NEOPIXEL2.2 49,6.7 49,3.7 50.8,1.9 66.2,1.9 NEOPIXEL3.4
N$12
  Bottom 1.016: C18.2 78.4,12.5 78.2,12.3
  Bottom 1.27: J4.SHLD2 J4.SHLD1 78.5,7.61 J4.GND 78.2,9.05 78.2,12.3 | 78.4,12.5 78.4,14.4 U$17.D U$16.D
N$13
  Bottom 0.406: IC3.2 63.79,27.7 R30.1
N$14
  Bottom 0.406: R12.1 39.24,28.91 IC2.1
N$15
  Bottom 0.406: IC1.1 21.75,28.91 R7.1
N$16
  Bottom 0.406: IC1.2 20.91,27.64 R8.1
N$17
  Bottom 0.254: NEOPIXEL1.4 20.3,4.9 17.9,7.3 R6.1
N$19
  Bottom 0.203: R9.1 13.03,27.64 IC1.7
  Bottom 1.016: C13.1 13.4,12.5 13.5,12.4 13.8,12.1
  Bottom 2.54: R9.1 13.8,21.8 13.8,12.1 | 13.5,12.4 J1.VBUS
N$20
  Bottom 0.406: NEOPIXEL3.2 73.1,6.6 73.1,3 74.5,1.6 89.9,1.6 NEOPIXEL4.4
N$21
  Bottom 0.203: R10.1 31.03,27.64 IC2.7
  Bottom 1.016: C14.1 35,12.7 37.4,12.7 37.5,12.6
  Bottom 2.54: R10.1 28.5,24.6 31.5,21.6 35.6,21.6 37.5,19.7 37.5,12.6 J2.VBUS
N$22
  Bottom 0.203: IC3.7 56.53,27.64 R11.1
  Bottom 1.016: C17.1 58.8,12.7 61.5,12.7
  Bottom 2.54: R11.1 56.8,22.3 58.6,22.3 61.5,19.4 61.5,12.7 J3.VBUS
N$24
  Bottom 0.203: IC4.7 82.03,27.64 R14.1
  Bottom 1.016: C18.1 83.2,12.7 85.5,12.7
  Bottom 2.54: R14.1 79.5,23.7 81.3,21.9 83.3,21.9 85.5,19.7 85.5,12.7 J4.VBUS
NEOPIXEL  (via drill 0.35)
  Top 0.305: v18.97,41.38 15.32,45.03 15.32,47.32 15.54,47.55 16.69,47.55 | 16.69,47.55 17.14,47.55 18.29,46.41 IC7.IO0 | v15.16,23.93 15.16,26.22 11.43,29.95 v11.43,33.38 | v16.69,47.78 16.69,47.55
  Bottom 0.305: v18.97,41.38 21.72,41.38 RN2.2 | v15.16,23.93 15.66,23.93 17.83,21.76 17.83,11.65 R6.2 | v11.43,33.38 11.43,43.32 15.89,47.78 v16.69,47.78 20.12,51.21 22.82,51.21 FLASH.1
RST  (via drill 0.35)
  Top 0.406: v33.7,43.9 33.7,41.3 27.07,34.67 20.65,34.67 19.66,35.66 v15.86,35.66 15.67,35.47 12.32,35.47 10.37,33.52 IC7.RST 8.88,29.73 v7.55,29.73
  Bottom 0.305: v33.7,43.9 33.9,44.1 35.7,44.1 36.47,44.87 IC12.6
  Bottom 0.406: RN2.1 21.43,40.03 17.83,40.03 15.86,38.06 v15.86,35.66 | v7.55,29.73 4.93,27.1 RESET.1
RX
  Top 1.016: IC7.RXD/IO3 12.37,48.9 13.5,50.03 PROGRAMMING.2
S1+
  Top 0.254: R2.2 15.65,16 R3.2 17.35,15.9 18.85,14.4 20,14.4 21.2,13.2 21.2,12.4 20.43,11.62 IC11.8 17.44,10 16.3,10 15.91,10.39 12.58,10.39 10.72,12.25 U$6.4
S1-
  Top 0.254: R4.2 13.45,16 14.45,15 16.5,15 17.75,13.76 17.75,12.93 IC11.6 19.02,12.88 17.71,12.88 17.08,12.25 U$7.4
  Top 0.406: 13.45,16 R1.2
S2+
  Top 0.254: IC11.4 25.54,13.57 25.71,13.75 29.85,13.75 U$8.4 29.7,13.9 29.7,16 | R17.2 29.7,16 | R18.2 29.7,16
S2-
  Top 0.254: R13.2 25.9,16.05 R19.2 25.85,15.25 25.5,14.9 24,14.9 23.4,14.3 23.4,12.8 23.7,12.5 | IC11.2 23.93,12.28 23.7,12.5 | 23.7,12.5 23.7,11.4 24.1,11 30.12,11 31,11.88 31,13.9 31.3,14.2 33.4,14.2 33.95,13.65 U$9.4
S3+
  Top 0.254: IC10.8 66.46,11.62 66.04,11.2 66.04,11.04 64.84,9.84 58.46,9.84 57.85,10.45 57.85,12.05 U$10.4 | R23.2 65.3,16.05 R24.2
  Top 0.305: R24.2 65.38,15.77 66.98,14.17 68.12,14.17 69.27,13.03 69.27,12.57 68.35,11.66 67.21,11.66 IC10.8
S3-
  Top 0.254: R25.2 61.45,16 R20.2 62.45,15.1 64.5,15.1 64.9,14.7 64.9,14.25 66.22,12.93 | 66.22,12.93 IC10.6 | 66.22,12.93 65.15,11.85 63.15,11.85 U$11.4
S4+
  Top 0.254: R28.2 79.4,16.05 R27.2 77.7,14.8 | U$12.4 77.7,14.8 | 77.7,14.8 76.47,13.57 IC10.4
S4-
  Top 0.254: 71.8,12.1 71.8,11.3 72,11.1 77,11.1 78.1,10 81.3,10 81.8,10.5 81.8,13.1 82.25,13.55 U$13.4 | IC10.2 71.97,12.28 71.8,12.1 | 71.8,12.1 71.5,12.4 71.5,14.2 72,14.7 72.8,14.7 73.85,15.75 R29.2 73.9,16.05 R26.2
SCL  (via drill 0.35)
  Top 0.305: v79,20.99 85.87,20.99 v86.95,22.07 | v20.34,24.23 24.05,24.23 24.45,24.63 34.59,24.63 v35.29,23.93 35.68,23.55 37.49,23.55 38.18,24.23 38.18,37.09 45.65,44.56 45.68,44.56 v46.05,44.93 47.35,43.63 56.26,43.63 71.09,28.8 v71.55,28.8 | v14.4,44.35 14.4,46.18 IC7.IO5 | I2C.3 37.27,50.97 33.82,47.52 v30.72,47.52
  Bottom 0.305: 71.55,27.35 69.35,25.15 63.78,25.15 IC3.4 | v79,20.99 72.74,27.25 71.55,27.25 71.55,27.35 | v86.95,22.07 88.49,23.61 IC4.4 | v20.34,24.23 19.66,24.92 IC1.4 | v35.29,23.93 35.39,23.83 36.48,24.92 37.72,24.92 IC2.4 | R21.1 13.7,43.38 14.54,44.21 | 14.54,44.21 14.94,44.61 14.99,44.56 16.72,46.29 29.5,46.29 IC12.1 30.18,45.72 30.18,46.98 v30.72,47.52 | 14.54,44.21 v14.4,44.35 | v71.55,28.8 71.55,27.35 | I2C.3 37.47,52.6 45.14,44.93 v46.05,44.93
SDA  (via drill 0.35)
  Top 0.305: v62.41,28.57 62.41,33.38 v61.77,34.02 | v21.26,25.6 21.26,25.86 29.48,34.08 | 29.48,34.08 29.53,34.13 32.55,31.12 32.55,30.32 v36.35,26.52 | 29.48,34.08 28.88,34.68 28.88,35.38 34.7,41.2 34.7,44.4 34.3,44.8 33.71,44.8 33.7,44.81 | 33.7,44.81 33.45,44.81 29.4,40.76 21.64,40.76 v19.43,42.98 17.37,45.03 17.37,45.26 16.46,46.18 IC7.IO4 | 33.7,44.81 33.7,46.49 I2C.4
  Bottom 0.305: v62.41,28.57 62.41,27.2 63.09,26.52 63.55,26.52 IC3.3 | IC4.3 88.92,26.29 89.84,27.2 89.84,29.49 85.31,34.02 v61.77,34.02 62.77,35.02 62.77,51.42 60.85,53.34 55.85,53.34 54.18,51.66 42.52,51.66 41.58,52.6 I2C.4 | R22.1 16,42.98 v19.43,42.98 19.43,44.22 20.09,44.88 28.59,44.88 29.62,43.85 30.73,43.85 31.32,44.43 31.32,45.49 IC12.2 | v21.26,25.6 20.57,26.29 19.66,26.29 IC1.3 | v36.35,26.52 37.72,26.52 IC2.3
TX
  Top 1.016: IC7.TXD/IO1 10.37,51.34 PROGRAMMING.1
VCC  (via drill 0.35)
  Top 0.254: IC5.14 45.22,20.06 v44.73,20.06 | IC5.22 50,20.96 v50,20.7 | IC5.25 50.2,23.39 v51.4,22.2 | IC5.3 44.56,26.4 C27.1 47.4,29.9 R5.1 | R15.1 42.36,22.2 v42.8,21.76 43.44,21.76 43.6,21.6 43.93,21.6 IC5.10 | v48.5,19.3 48.5,19.63 IC5.18 | v26.5,8.7 26.5,7.1 | v17.2,8 18.3,8 19.1,7.2 | v64.9,11.1 64.1,10.3 59,10.3 58.6,10.7 58.6,12.6 58.3,12.9 U$10.5 | U$6.5 11.02,12.9 11.6,12.32 11.6,12.08 12.88,10.8 v16.75,10.8 | U$7.5 16.5,12.9 v16.7,13.1 | v27.55,13 29.95,13 U$8.5 | U$9.5 34.6,12.9 34.9,13.2 34.9,14 35.3,14.4 42.8,14.4 v43,14.6 | U$13.5 83.6,12.9 83.8,13.1 83.8,14 84.66,14.86 | U$12.5 79.7,12.9 79.9,13.1 79.9,14.1 80.66,14.86 84.66,14.86 | 84.66,14.86 89.2,14.86 | U$11.5 64.87,12.9 v64.9,12.87
  Top 0.305: 24.23,31.32 IC7.VCC | v39.09,26.75 43.2,26.75 43.43,26.52 43.89,26.52 C27.1 | IC5.26 49.84,23.77 50.06,23.55 IC5.25
  Top 0.406: 89.2,8.6 89.3,8.5 v91,8.5 | 86.45,27.45 86.45,27.54 87.04,27.54 v87.1,27.6
  Top 0.61: v66.9,8.2 66.9,7.1
  Top 1.016: IC8.2 83.19,30.8 84.75,29.25 | 86.45,27.54 84.75,29.25 | C16.2 C15.2 77.95,28 80.75,30.8 IC8.2 | IC8.4 IC8.2 | 43,7.1 66.9,7.1 87.7,7.1 89.2,8.6 89.2,14.86 89.2,24.7 86.45,27.45 | 43,7.1 26.5,7.1 19.2,7.1 19.1,7.2 v19.1,8.4 | 43,7.1 v43,8.4 | 24.23,31.32 24.23,32.57 23.7,33.1 17.8,33.1 | 17.8,33.1 15.2,33.1 14.37,32.27 IC7.EN 14.37,30.43 16,28.8 v16,28.6 | v17.83,34.69 17.83,33.13 17.8,33.1 | 84.75,29.25 85.6,30.1 85.6,37.9 v85.1,38.4
  Bottom 0.254: v26.5,8.7 26.5,11.86 27.55,12.9 v27.55,13 | v17.2,8 17.2,8.7 16.95,8.95 16.95,10.6 v16.75,10.8 16.45,11.1 16.45,12.85 v16.7,13.1
  Bottom 0.305: v43,8.4 44.3,8.4 | IC4.5 84.59,25.09 v87.1,27.6 87.14,27.64 IC4.2 IC4.1 | RN2.6 23.09,41.83 23.09,41.38 RN2.7 23.09,41.15 23.07,41.13 RN2.8 23.07,39.02 22.82,38.77 | IC2.5 32.46,25.15 33.83,25.15 36.12,27.43 37.72,27.43 IC2.2 37.95,27.43 38.41,27.43 v39.09,26.75 39.09,25.6 42.75,21.95 v42.8,21.76 | IC3.5 58.29,25.15 59.55,25.15 61.72,27.32 61.72,29.03 61.95,29.26 63.32,29.26 63.55,29.03 IC3.1 | v17.83,34.69 17.73,34.59 15.11,34.59 13.7,36 R21.2 R22.2 | C4.1 68.35,8.35 68.3,8.3 | 16,25.3 15.79,25.09 IC1.5 | NEOPIXEL1.1 20.3,10.15
  Bottom 0.406: NEOPIXEL1.1 20.3,8.3 20.2,8.4 v19.1,8.4 | 20.3,10.15 C2.1 | NEOPIXEL2.1 44.3,8.4 44.3,10.15 C3.1 | NEOPIXEL3.1 68.3,8.3 67,8.3 v66.9,8.2 | C19.1 92.3,10.15 NEOPIXEL4.1 91.8,8.5 v91,8.5
  Bottom 0.61: v42.8,21.76 44.5,20.06 v44.73,20.06 46.09,18.7 47.1,18.7 47.9,18.7 v48.5,19.3 49.9,20.7 v50,20.7 51.4,22.1 v51.4,22.2 | v66.9,8.2 66.9,9.1 v64.9,11.1 v64.9,12.87 64.9,20.07 59.88,25.09 IC3.5 | IC12.18 30.12,38.04 30.28,38.2
  Bottom 0.813: v17.83,34.69 17.63,34.89 17.63,37.73 18.68,38.77 RN3.5 RN3.6 RN3.7 RN3.8 22.82,38.77 23.4,38.2 30.28,38.2 31.2,38.2 36.7,43.7 41.4,43.7 41.8,44.1 41.8,46.7 38.5,50 36.7,50 34.73,51.97 I2C.2
  Bottom 1.016: v43,8.4 v43,14.6 47.1,18.7 | v19.1,8.4 19.4,8.7 19.4,13.13 19.3,13.23 19.3,22 16,25.3 v16,28.6 | v85.1,38.4 87.05,36.45 C36.1
VIN  (via drill 0.35)
  Top 1.016: C21.1 C22.1 79.75,34.65 81.31,33.09 IC8.3 82.24,32.9 v83.5,32.9
  Bottom 0.203: IC2.8 32.27,30.87 32.3,30.9 | IC1.8 14.2,28.93 14.2,30.9 | IC3.8 58.27,30.87 58.3,30.9 | IC4.8 81.49,28.91 R14.2
  Bottom 1.016: v83.5,32.9 81.5,32.9 R14.2
  Bottom 2.54: R14.2 58.3,30.9 R11.2 | R9.2 14.2,30.9 R10.2 32.3,30.9 R11.2 | POWER.1 57.46,34.36 R11.2

### Text on the board
tPlace: + - | + | 10uF | AMS1117-3.3v | 22pf | 1.5k | 22pf | SN75240 | 1.5k | 10uF | 15k | 27pf | 27Ω | 27Ω | 27Ω | 27Ω | 22pf | 22pf | 22pf | 22pf | 22pf | 22pf | 15k | 15k | 15k | 15k | 15k | 15k | SN75240 | SN75240
bPlace: - + | SCL | SDA | 3.3v | TX | RX | 6MHZ | MCP23008 | Austins Creations / Smart USB Hub | 4.7k | V0.3.0 | INA219 | INA219 | INA219 | INA219 | 10k | 10k | 1000uf | 10k | 0.1Ω | 0.1Ω | 0.1Ω | 0.1Ω | 100uF / TANTALUM | 100uF / TANTALUM | 100uF / TANTALUM | 100uF / TANTALUM | 470Ω